# EAGLE schematic express-card-max (EAGLE 7.5.0)
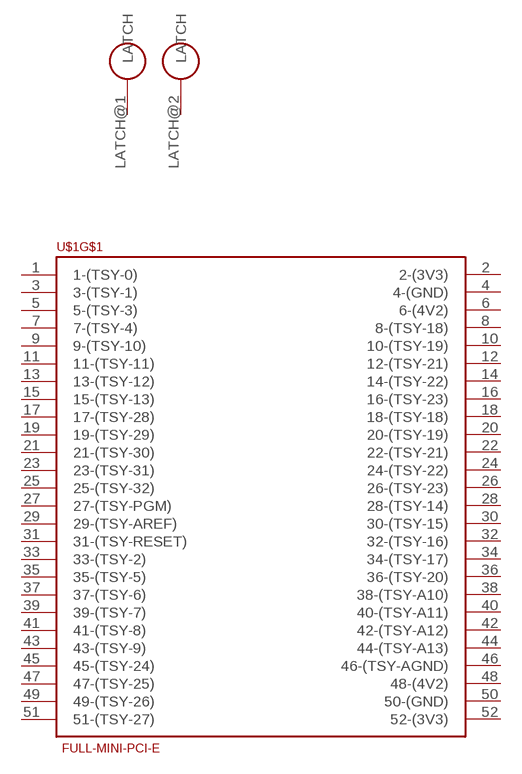
[diagram p0: schematic, sheet 1]

## Parts
U$1  FULL-MINI-PCI-E  [FULL-MINI-PCI-E]
Unconnected: U$1.1(1-(TSY-0)) U$1.2(2-(3V3)) U$1.3(3-(TSY-1)) U$1.4(4-(GND)) U$1.5(5-(TSY-3)) U$1.6(6-(4V2)) U$1.7(7-(TSY-4)) U$1.8(8-(TSY-18)) U$1.9(9-(TSY-10)) U$1.10(10-(TSY-19)) U$1.11(11-(TSY-11)) U$1.12(12-(TSY-21)) U$1.13(13-(TSY-12)) U$1.14(14-(TSY-22)) U$1.15(15-(TSY-13)) U$1.16(16-(TSY-23)) U$1.17(17-(TSY-28)) U$1.18(18-(TSY-18)) U$1.19(19-(TSY-29)) U$1.20(20-(TSY-19)) U$1.21(21-(TSY-30)) U$1.22(22-(TSY-21)) U$1.23(23-(TSY-31)) U$1.24(24-(TSY-22)) U$1.25(25-(TSY-32)) U$1.26(26-(TSY-23)) U$1.27(27-(TSY-PGM)) U$1.28(28-(TSY-14)) U$1.29(29-(TSY-AREF)) U$1.30(30-(TSY-15)) U$1.31(31-(TSY-RESET)) U$1.32(32-(TSY-16)) U$1.33(33-(TSY-2)) U$1.34(34-(TSY-17)) U$1.35(35-(TSY-5)) U$1.36(36-(TSY-20)) U$1.37(37-(TSY-6)) U$1.38(38-(TSY-A10)) U$1.39(39-(TSY-7)) U$1.40(40-(TSY-A11)) U$1.41(41-(TSY-8)) U$1.42(42-(TSY-A12)) U$1.43(43-(TSY-9)) U$1.44(44-(TSY-A13)) U$1.45(45-(TSY-24)) U$1.46(46-(TSY-AGND)) U$1.47(47-(TSY-25)) U$1.48(48-(4V2)) U$1.49(49-(TSY-26)) U$1.50(50-(GND)) U$1.51(51-(TSY-27)) U$1.52(52-(3V3))

## Power pins joined to a net without a drawn wire
LATCH: U$1.LATCH@1(LATCH) U$1.LATCH@2(LATCH)

## Library data of the parts
U$1 = teensy-express:FULL-MINI-PCI-E